# EAGLE design broncho_lung_breakout (EAGLE 9.1.1)
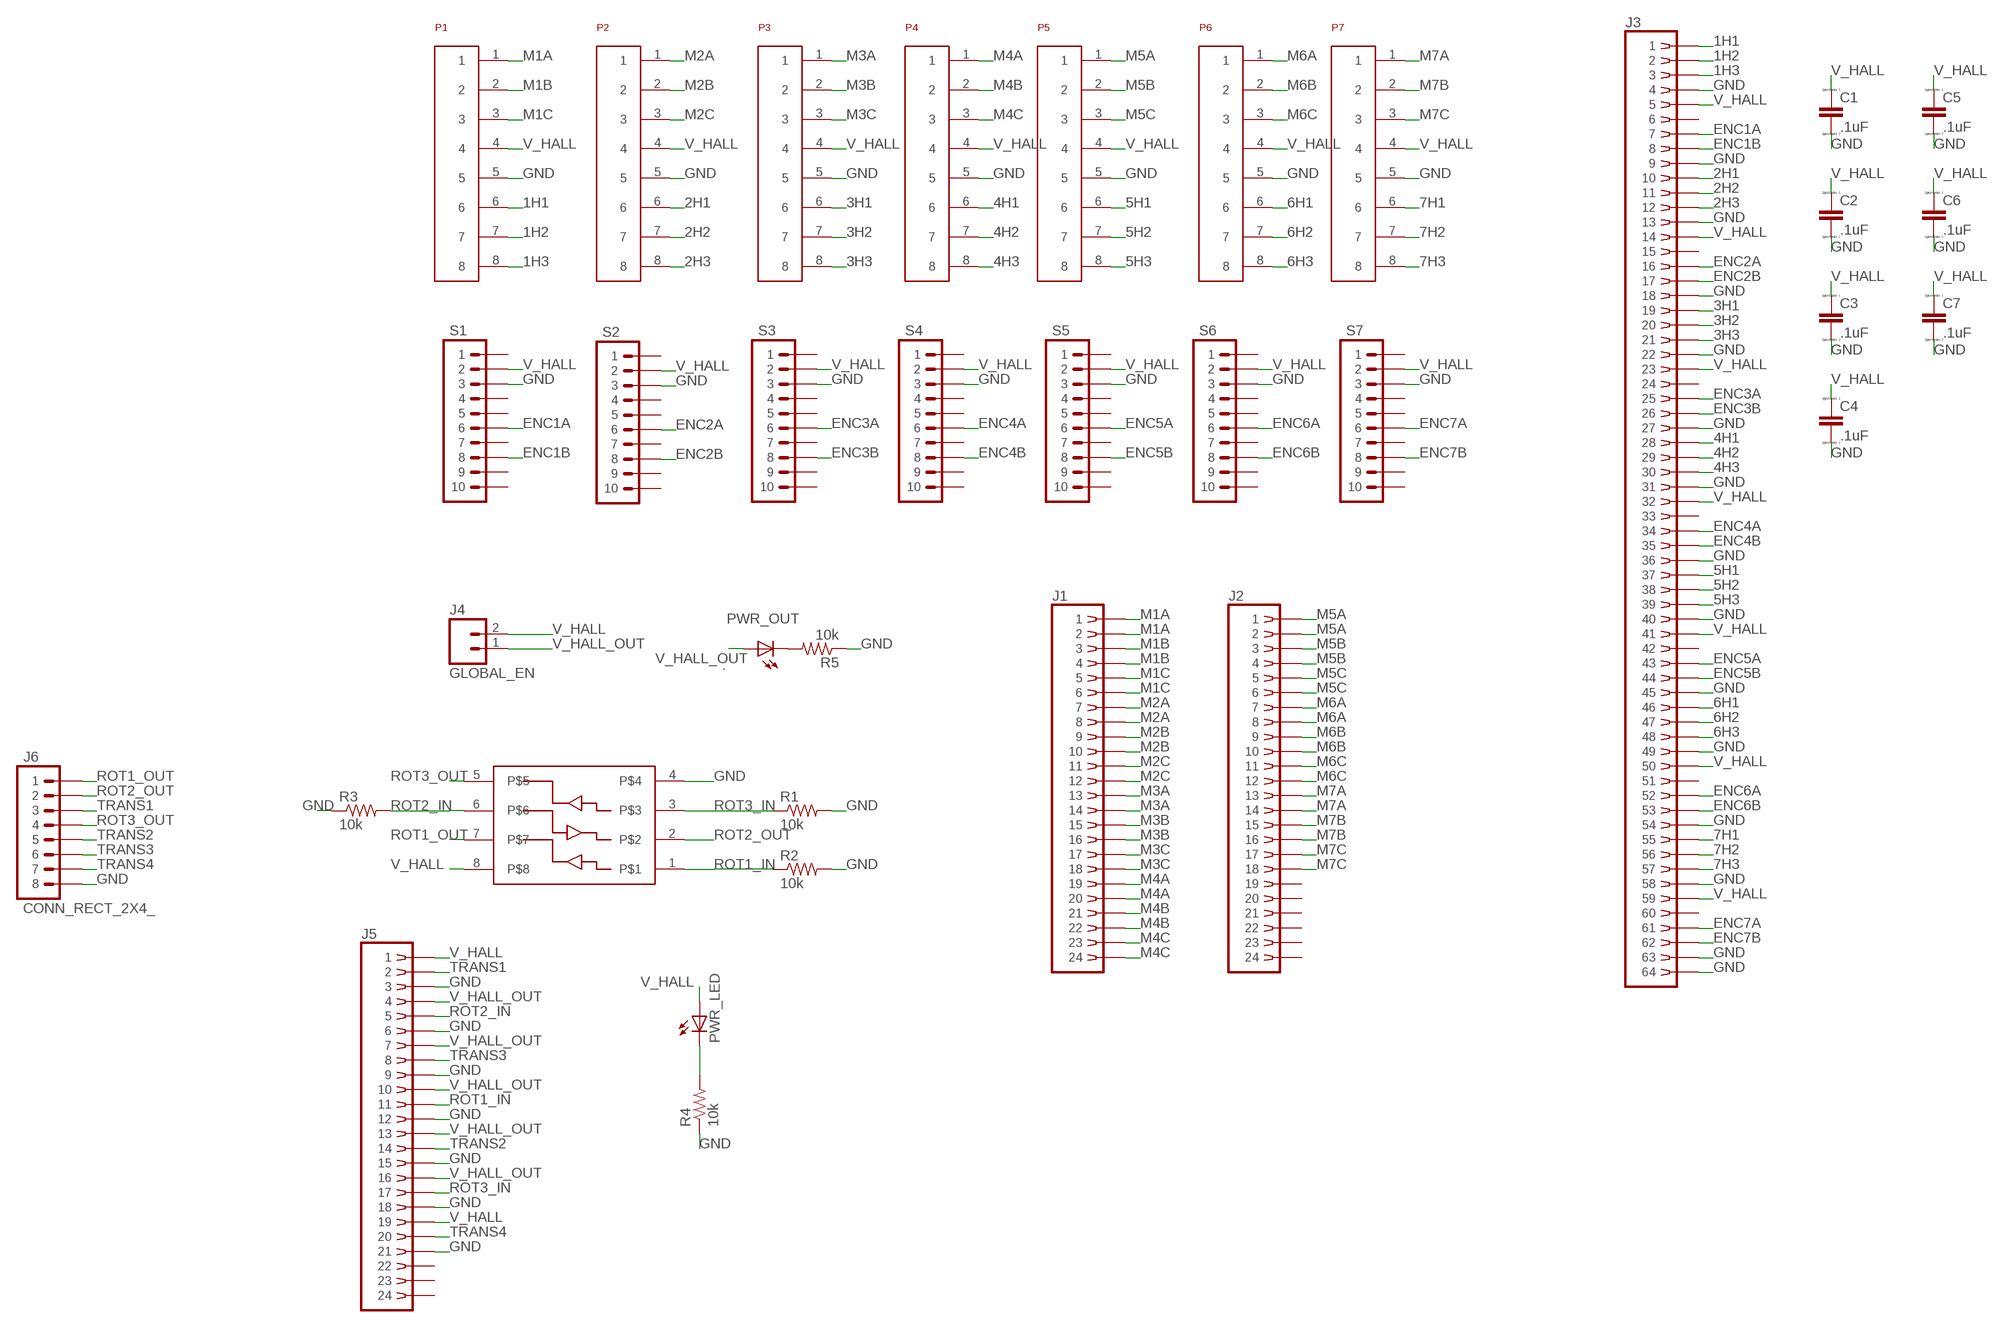
[diagram p0: schematic, sheet 1]

## Parts
C1  .1uF  CC0603  [C0603]
C2  .1uF  CC0603  [C0603]
C3  .1uF  CC0603  [C0603]
C4  .1uF  CC0603  [C0603]
C5  .1uF  CC0603  [C0603]
C6  .1uF  CC0603  [C0603]
C7  .1uF  CC0603  [C0603]
J1  CONN_RECT_2X12TH  [CONN_IDC_24_MALE_TH]
J2  CONN_RECT_2X12TH  [CONN_IDC_24_MALE_TH]
J3  CONN_RECT_2X32NOHOLES  [CONN_IDC_64_MALE_TH_NOHOLES]
J4  GLOBAL_EN  22-27-2021-02  [6410-02]
J5  CONN_RECT_2X12TH  [CONN_IDC_24_MALE_TH]
J6  CONN_RECT_2X4_  [2X4]
P1  MKS-1650  [MKS-1650]
P2  MKS-1650  [MKS-1650]
P3  MKS-1650  [MKS-1650]
P4  MKS-1650  [MKS-1650]
P5  MKS-1650  [MKS-1650]
P6  MKS-1650  [MKS-1650]
P7  MKS-1650  [MKS-1650]
PWR_LED  .  LED-0805  [LED-0805]
PWR_OUT  .  LED-0805  [LED-0805]
R1  10k  RESISTOR-0603  [0603-RES]
R2  10k  RESISTOR-0603  [0603-RES]
R3  10k  RESISTOR-0603  [0603-RES]
R4  10k  RESISTOR-0603  [0603-RES]
R5  10k  RESISTOR-0603  [0603-RES]
S1  CONN_RECT_2X5'_VERT  [2X5]
S2  CONN_RECT_2X5'_VERT  [2X5]
S3  CONN_RECT_2X5'_VERT  [2X5]
S4  CONN_RECT_2X5'_VERT  [2X5]
S5  CONN_RECT_2X5'_VERT  [2X5]
S6  CONN_RECT_2X5'_VERT  [2X5]
S7  CONN_RECT_2X5'_VERT  [2X5]
U1  INVERTER_3INP  [SOP65P405X120-8]

## Nets
1H1: J3.P$1 P1.6
1H2: J3.P$2 P1.7
1H3: J3.P$3 P1.8
2H1: J3.P$10 P2.6
2H2: J3.P$11 P2.7
2H3: J3.P$12 P2.8
3H1: J3.P$19 P3.6
3H2: J3.P$20 P3.7
3H3: J3.P$21 P3.8
4H1: J3.P$28 P4.6
4H2: J3.P$29 P4.7
4H3: J3.P$30 P4.8
5H1: J3.P$37 P5.6
5H2: J3.P$38 P5.7
5H3: J3.P$39 P5.8
6H1: J3.P$46 P6.6
6H2: J3.P$47 P6.7
6H3: J3.P$48 P6.8
7H1: J3.P$55 P7.6
7H2: J3.P$56 P7.7
7H3: J3.P$57 P7.8
ENC1A: J3.P$7 S1.6
ENC1B: J3.P$8 S1.8
ENC2A: J3.P$16 S2.6
ENC2B: J3.P$17 S2.8
ENC3A: J3.P$25 S3.6
ENC3B: J3.P$26 S3.8
ENC4A: J3.P$34 S4.6
ENC4B: J3.P$35 S4.8
ENC5A: J3.P$43 S5.6
ENC5B: J3.P$44 S5.8
ENC6A: J3.P$52 S6.6
ENC6B: J3.P$53 S6.8
ENC7A: J3.P$61 S7.6
ENC7B: J3.P$62 S7.8
GND: C1.2 C2.2 C3.2 C4.2 C5.2 C6.2 C7.2 J3.P$4 J3.P$9 J3.P$13 J3.P$18 J3.P$22 J3.P$27 J3.P$31 J3.P$36 J3.P$40 J3.P$45 J3.P$49 J3.P$54 J3.P$58 J3.P$63 J3.P$64 J5.P$3 J5.P$6 J5.P$9 J5.P$12 J5.P$15 J5.P$18 J5.P$21 J6.8 P1.5 P2.5 P3.5 P4.5 P5.5 P6.5 P7.5 R1.2 R2.2 R3.1 R4.1 R5.1 S1.3 S2.3 S3.3 S4.3 S5.3 S6.3 S7.3 U1.4
M1A: J1.P$1 J1.P$2 P1.1
M1B: J1.P$3 J1.P$4 P1.2
M1C: J1.P$5 J1.P$6 P1.3
M2A: J1.P$7 J1.P$8 P2.1
M2B: J1.P$9 J1.P$10 P2.2
M2C: J1.P$11 J1.P$12 P2.3
M3A: J1.P$13 J1.P$14 P3.1
M3B: J1.P$15 J1.P$16 P3.2
M3C: J1.P$17 J1.P$18 P3.3
M4A: J1.P$19 J1.P$20 P4.1
M4B: J1.P$21 J1.P$22 P4.2
M4C: J1.P$23 J1.P$24 P4.3
M5A: J2.P$1 J2.P$2 P5.1
M5B: J2.P$3 J2.P$4 P5.2
M5C: J2.P$5 J2.P$6 P5.3
M6A: J2.P$7 J2.P$8 P6.1
M6B: J2.P$9 J2.P$10 P6.2
M6C: J2.P$11 J2.P$12 P6.3
M7A: J2.P$13 J2.P$14 P7.1
M7B: J2.P$15 J2.P$16 P7.2
M7C: J2.P$17 J2.P$18 P7.3
N$1: PWR_OUT.C R5.2
N$2: PWR_LED.C R4.2
ROT1_IN: J5.P$11 R2.1 U1.1
ROT1_OUT: J6.1 U1.7
ROT2_IN: J5.P$5 R3.2 U1.6
ROT2_OUT: J6.2 U1.2
ROT3_IN: J5.P$17 R1.1 U1.3
ROT3_OUT: J6.4 U1.5
TRANS1: J5.P$2 J6.3
TRANS2: J5.P$14 J6.5
TRANS3: J5.P$8 J6.6
TRANS4: J5.P$20 J6.7
V_HALL: C1.1 C2.1 C3.1 C4.1 C5.1 C6.1 C7.1 J3.P$5 J3.P$14 J3.P$23 J3.P$32 J3.P$41 J3.P$50 J3.P$59 J4.2 J5.P$1 J5.P$19 P1.4 P2.4 P3.4 P4.4 P5.4 P6.4 P7.4 PWR_LED.A S1.2 S2.2 S3.2 S4.2 S5.2 S6.2 S7.2 U1.8
V_HALL_OUT: J4.1 J5.P$4 J5.P$7 J5.P$10 J5.P$13 J5.P$16 PWR_OUT.A
Unconnected: J2.P$19 J2.P$20 J2.P$21 J2.P$22 J2.P$23 J2.P$24 J3.P$6 J3.P$15 J3.P$24 J3.P$33 J3.P$42 J3.P$51 J3.P$60 J5.P$22 J5.P$23 J5.P$24 S1.1 S1.4 S1.5 S1.7 S1.9 S1.10 S2.1 S2.4 S2.5 S2.7 S2.9 S2.10 S3.1 S3.4 S3.5 S3.7 S3.9 S3.10 S4.1 S4.4 S4.5 S4.7 S4.9 S4.10 S5.1 S5.4 S5.5 S5.7 S5.9 S5.10 S6.1 S6.4 S6.5 S6.7 S6.9 S6.10 S7.1 S7.4 S7.5 S7.7 S7.9 S7.10

## Library data of the parts
C1-C7 = eagle-ltspice:C: CAPACITOR, European symbol; SPICEMODEL: NONE; SPICEPREFIX: C
J1 J2 J5 = Cannula_1_0:CONN_RECT_2X12
J3 = Cannula_1_0:CONN_RECT_2X32
J4 = Cannula_1_0:22-?-02: CONNECTOR wire to board 2.54 mm (.1 inch) pitch header; OC_FARNELL: unknown; OC_NEWARK: unknown
J6 = Cannula_1_0:CONN_RECT_2X4
P1-P7 = stocko_rfk_conn:MKS-1650: MKS 1650 8 Pin Connector Stocko-Contact Designed by Max Emerson Link to datasheet <https://www.stocko-contact.com/info-pdf/rfk_1650.pdf>
PWR_LED PWR_OUT = Cannula_1_0:LED
R1-R5 = Cannula_1_0:RESISTOR
S1-S7 = Cannula_1_0:CONN_RECT_2X5
U1 = SOP65P405X120-8:INVERTER_3INP

## Net classes
1 M1A: width 0.508 mm
2 M1B: width 0.508 mm
3 M1C: width 0.508 mm
4 M2A: width 0.508 mm
5 M2B: width 0.508 mm
6 M2C: width 0.508 mm
7 M3A: width 0.508 mm
8 M3B: width 0.508 mm
9 M3C: width 0.508 mm
10 M4A: width 0.508 mm
11 M4B: width 0.508 mm
12 M4C: width 0.508 mm
13 M5A: width 0.508 mm
14 M5B: width 0.508 mm
15 M5C: width 0.508 mm

## Board
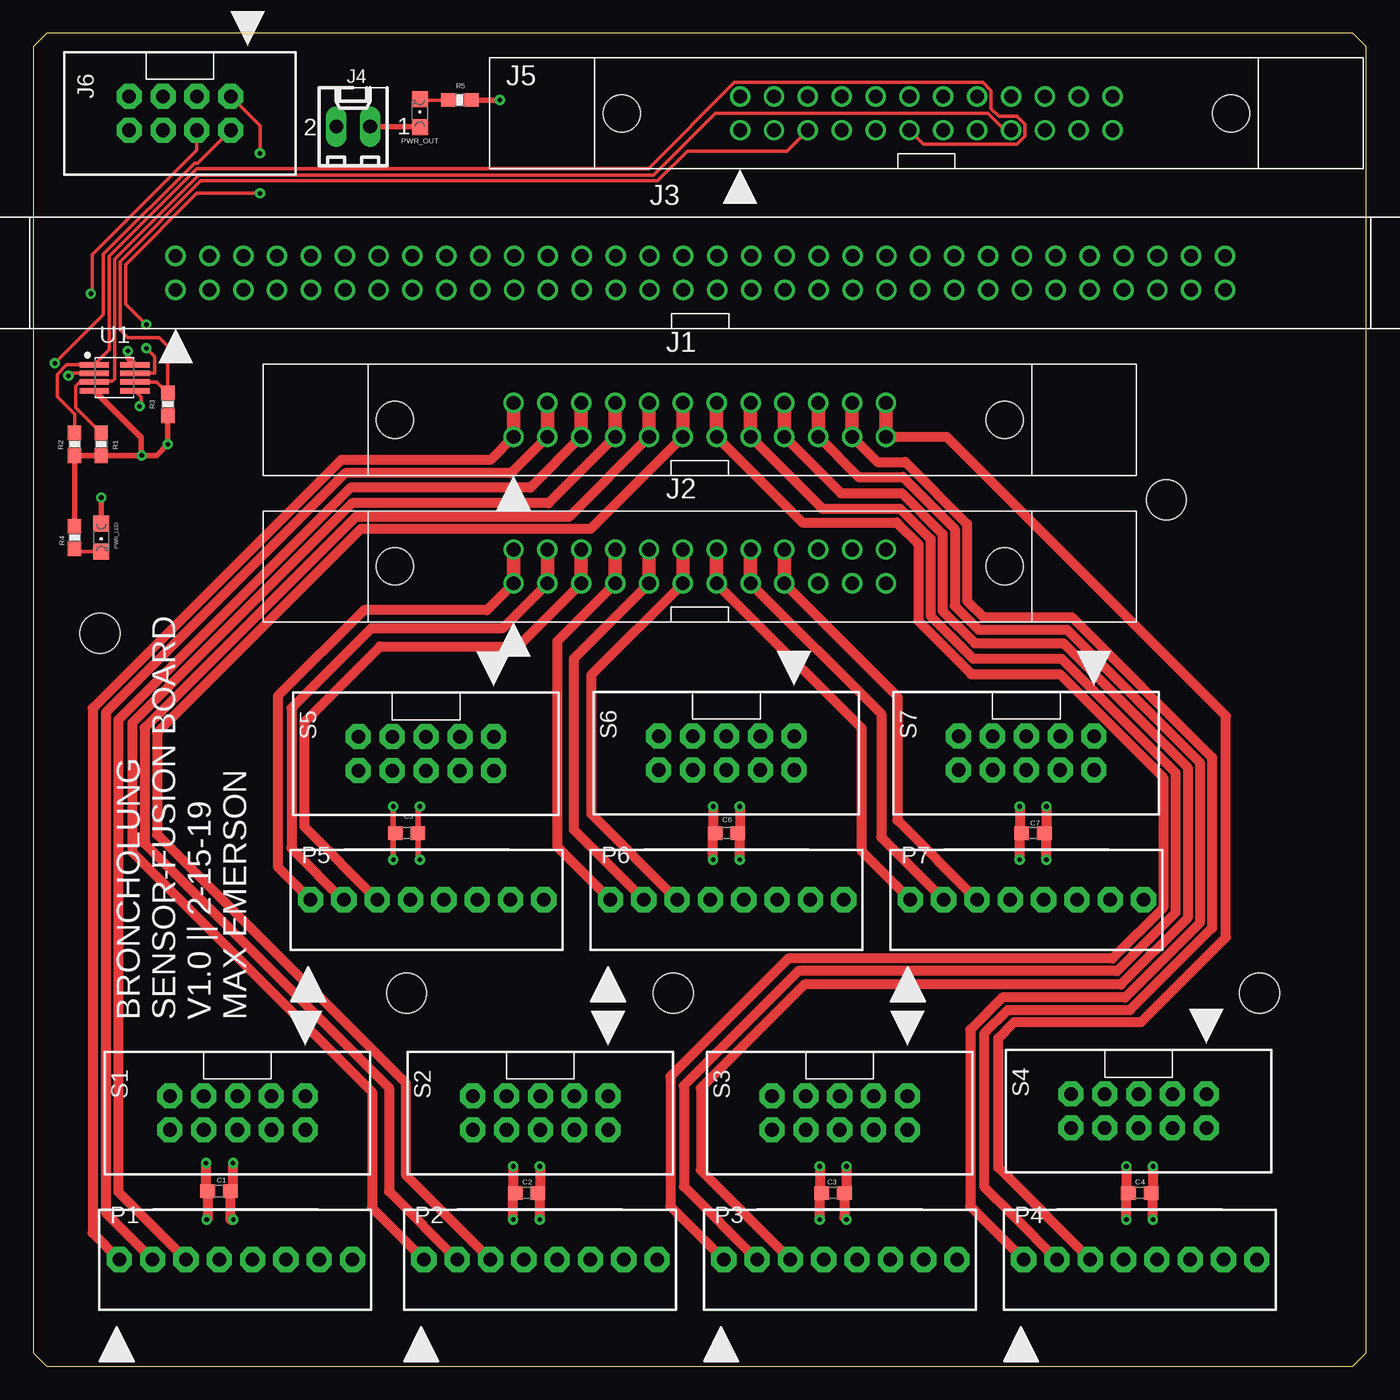
[diagram p1: board, top side]
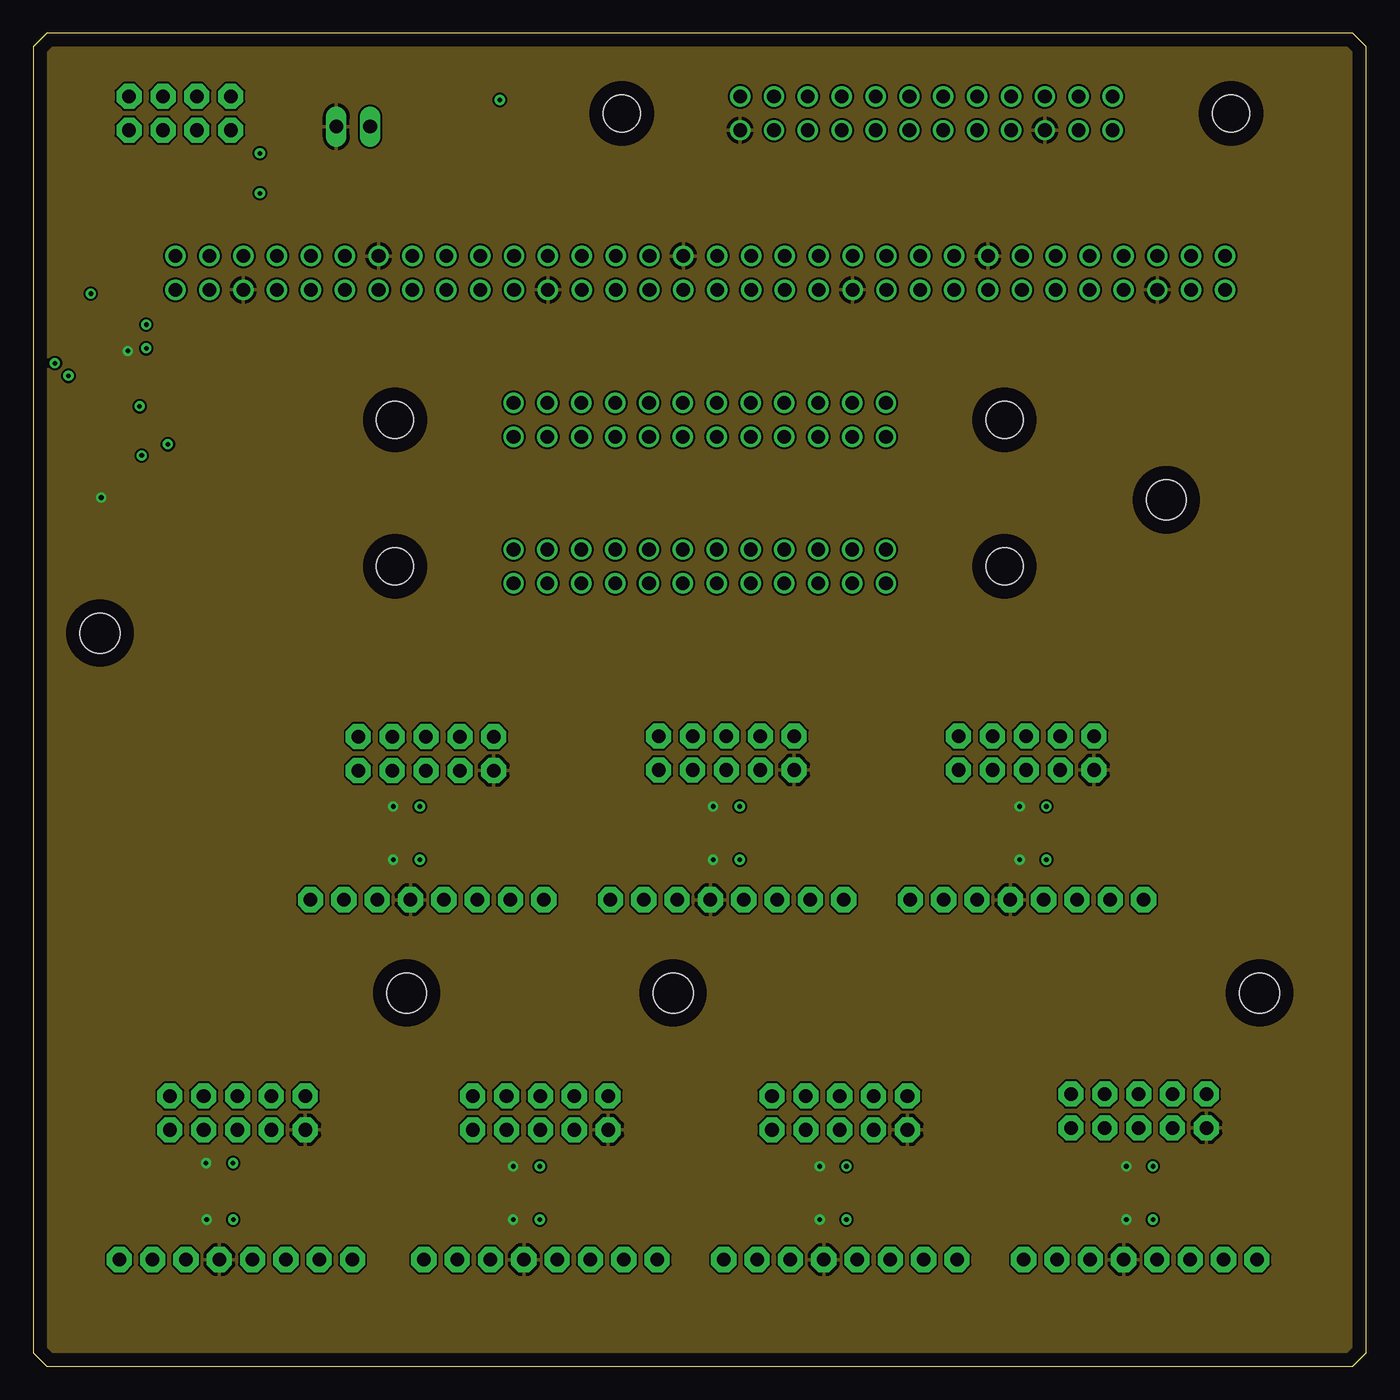
[diagram p2: board, inner layer Route2]
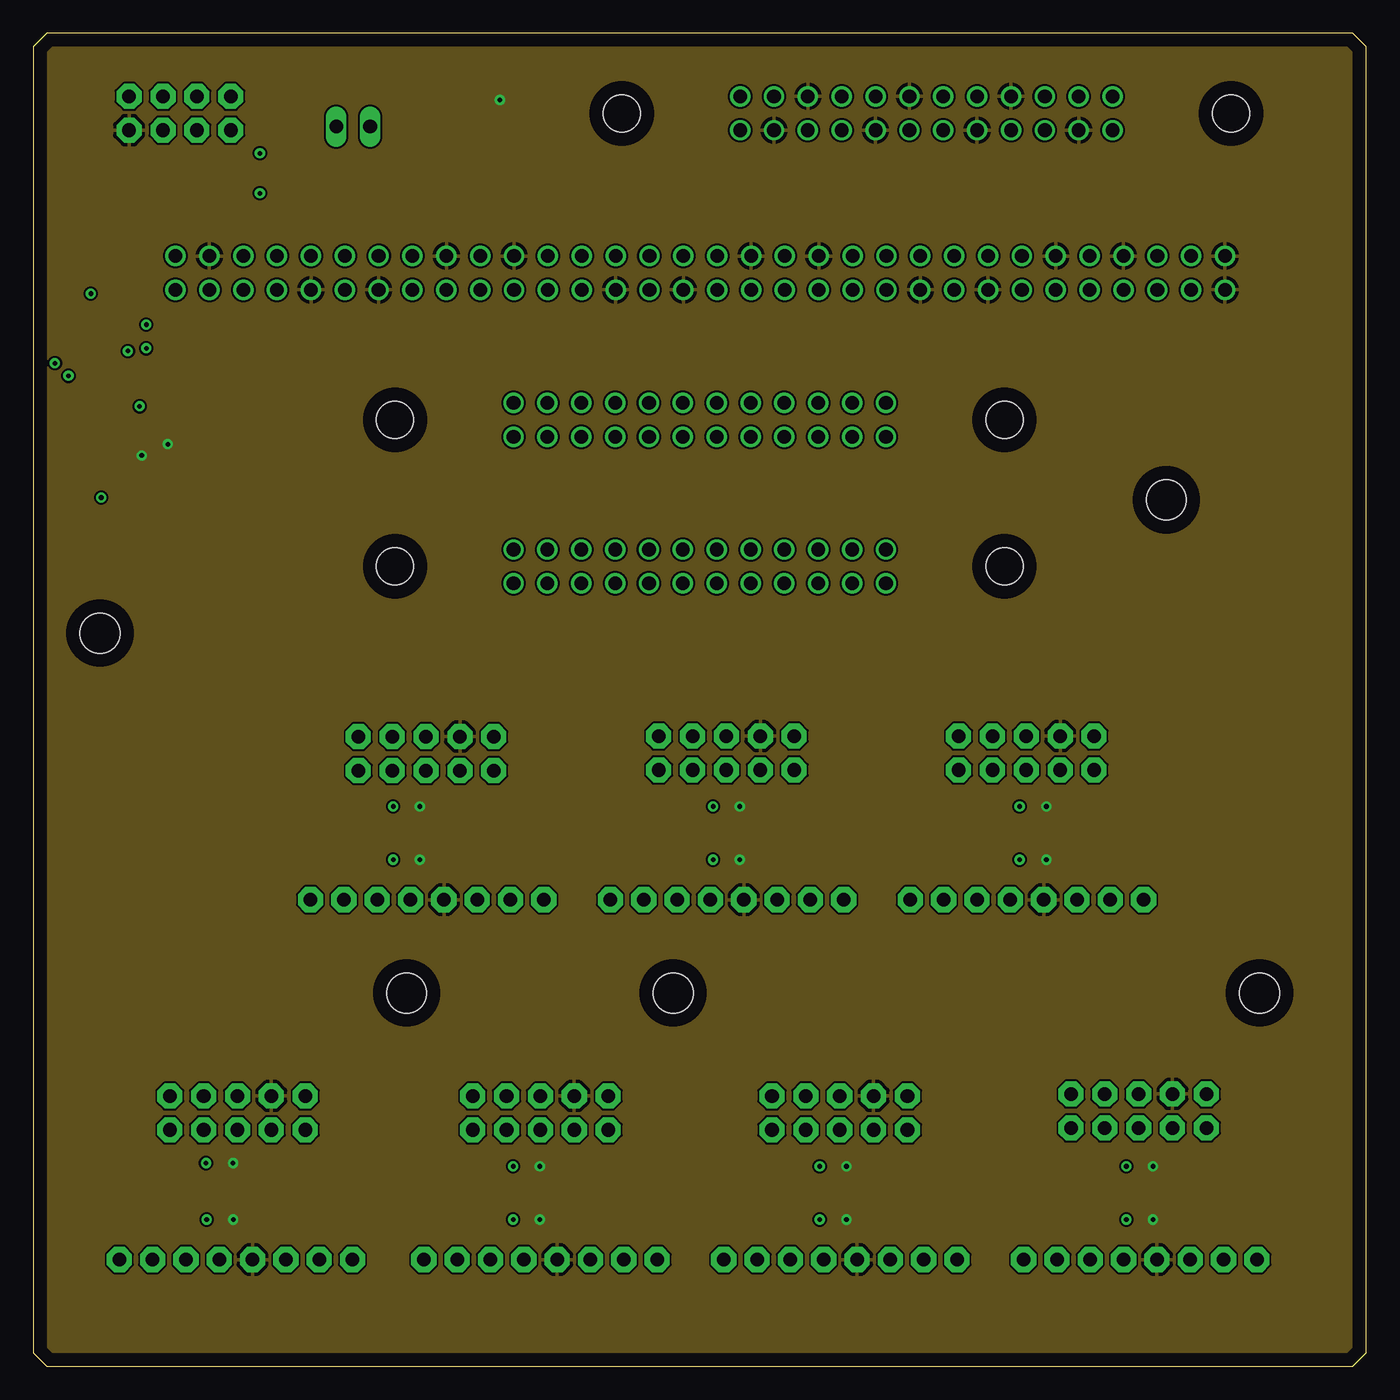
[diagram p3: board, inner layer Route15]
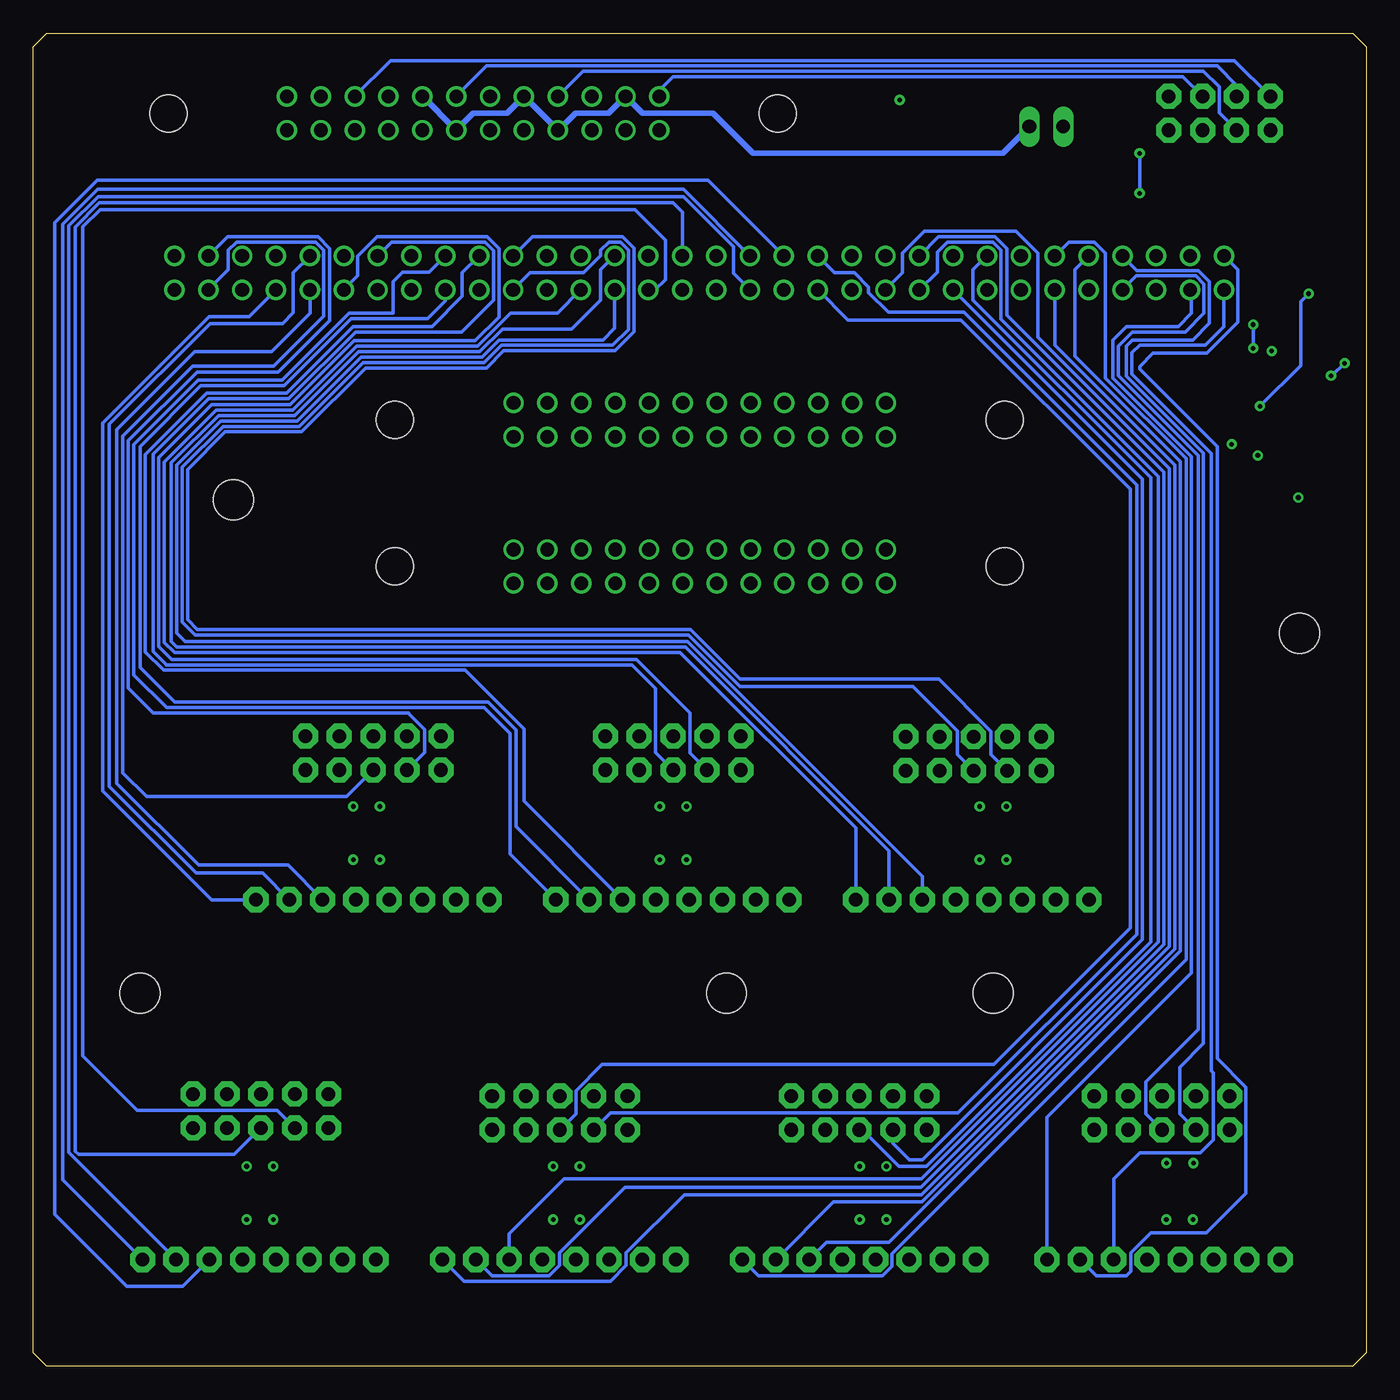
[diagram p4: board, bottom side, seen from below]

Size 100 x 100 mm. Coordinates in mm from the lower left corner, seen from the top.
Outline: 0,99 0,1 1,0 99,0 100,1 100,99 99,100 1,100 0,99
Copper layers (1*2*15*16): Top 0.035mm / dielectric 1.5mm / Route2 0.035mm / dielectric 0.15mm / Route15 0.035mm / dielectric 0.2mm / Bottom 0.035mm
Design rules "default *": minimum track width 10mil, minimum drill 0.35mm, track to track 6mil, track to pad 6mil, pad to pad 6mil, via to via 6mil, smd to smd 6mil, copper to edge 40mil, drill to drill 6mil, minimum pad ring 10mil, minimum via ring 8mil, stop-mask expansion 4mil, vias tented up to drill 0mil, thermal gap 10mil
Holes 3 mm at 28,28 48,28 5,55 92,28 85,65

### Footprints (pad centres in the part's own frame; a part is rotated, then mirrored left to right if it is on the bottom)
C0603 = smd 1.1 x 1: 1 -0.85,0; 2 0.85,0
CONN_IDC_24_MALE_TH = drill 1.02: P$1 -13.97,-1.27; P$2 -13.97,1.27; P$3 -11.43,-1.27; P$4 -11.43,1.27; P$5 -8.89,-1.27; P$6 -8.89,1.27; P$7 -6.35,-1.27; P$8 -6.35,1.27; P$9 -3.81,-1.27; P$10 -3.81,1.27; P$11 -1.27,-1.27; P$12 -1.27,1.27; P$13 1.27,-1.27; P$14 1.27,1.27; P$15 3.81,-1.27; P$16 3.81,1.27; P$17 6.35,-1.27; P$18 6.35,1.27; P$19 8.89,-1.27; P$20 8.89,1.27; P$21 11.43,-1.27; P$22 11.43,1.27; P$23 13.97,-1.27; P$24 13.97,1.27 | hole 2.794: -22.86,0; 22.86,0
CONN_IDC_64_MALE_TH_NOHOLES = drill 1.02: P$1 -39.37,-1.27; P$2 -39.37,1.27; P$3 -36.83,-1.27; P$4 -36.83,1.27; P$5 -34.29,-1.27; P$6 -34.29,1.27; P$7 -31.75,-1.27; P$8 -31.75,1.27; P$9 -29.21,-1.27; P$10 -29.21,1.27; P$11 -26.67,-1.27; P$12 -26.67,1.27; P$13 -24.13,-1.27; P$14 -24.13,1.27; P$15 -21.59,-1.27; P$16 -21.59,1.27; P$17 -19.05,-1.27; P$18 -19.05,1.27; P$19 -16.51,-1.27; P$20 -16.51,1.27; P$21 -13.97,-1.27; P$22 -13.97,1.27; P$23 -11.43,-1.27; P$24 -11.43,1.27; P$25 -8.89,-1.27; P$26 -8.89,1.27; P$27 -6.35,-1.27; P$28 -6.35,1.27; P$29 -3.81,-1.27; P$30 -3.81,1.27; P$31 -1.27,-1.27; P$32 -1.27,1.27; P$33 1.27,-1.27; P$34 1.27,1.27; P$35 3.81,-1.27; P$36 3.81,1.27; P$37 6.35,-1.27; P$38 6.35,1.27; P$39 8.89,-1.27; P$40 8.89,1.27; P$41 11.43,-1.27; P$42 11.43,1.27; P$43 13.97,-1.27; P$44 13.97,1.27; P$45 16.51,-1.27; P$46 16.51,1.27; P$47 19.05,-1.27; P$48 19.05,1.27; P$49 21.59,-1.27; P$50 21.59,1.27; P$51 24.13,-1.27; P$52 24.13,1.27; P$53 26.67,-1.27; P$54 26.67,1.27; P$55 29.21,-1.27; P$56 29.21,1.27; P$57 31.75,-1.27; P$58 31.75,1.27; P$59 34.29,-1.27; P$60 34.29,1.27; P$61 36.83,-1.27; P$62 36.83,1.27; P$63 39.37,-1.27; P$64 39.37,1.27
6410-02 = drill 1.016 long: 1 1.27,0; 2 -1.27,0
2X4 = drill 1.016 pad 1.88 octagon: 1 -1.27,3.81; 2 1.27,3.81; 3 -1.27,1.27; 4 1.27,1.27; 5 -1.27,-1.27; 6 1.27,-1.27; 7 -1.27,-3.81; 8 1.27,-3.81
MKS-1650 = drill 1.016 pad 1.88 octagon: 1 -8.7,0; 2 -6.2,0; 3 -3.7,0; 4 -1.2,0; 5 1.3,0; 6 3.8,0; 7 6.3,0; 8 8.8,0
LED-0805 = smd 1.2 x 1.2: A 0,-1.05; C 0,1.05
0603-RES = smd 1.1 x 1: 1 -0.85,0; 2 0.85,0
2X5 = drill 1.016 pad 1.88 octagon: 1 -1.27,5.08; 2 1.27,5.08; 3 -1.27,2.54; 4 1.27,2.54; 5 -1.27,0; 6 1.27,0; 7 -1.27,-2.54; 8 1.27,-2.54; 9 -1.27,-5.08; 10 1.27,-5.08
SOP65P405X120-8 = smd 2.196 x 0.412: 1 -1.527,0.975; 2 -1.527,0.325; 3 -1.527,-0.325; 4 -1.527,-0.975; 5 1.527,-0.975; 6 1.527,-0.325; 7 1.527,0.325; 8 1.527,0.975

### Placement (x,y rotation side)
C1  13.93,13.13 0 top
C2  37,13 0 top
C3  60,13 0 top
C4  83,13 0 top
C5  28,40 0 top
C6  52,40 0 top
C7  75,40 0 top
J1  50,71 0 top
J2  50,60 0 top
J3  50.04,82.03 0 top
J4  24,93 0 top
J5  67,94 0 top
J6  11,94 270 top
P1  15.15,8 0 top
P2  38,8 0 top
P3  60.5,8 0 top
P4  83,8 0 top
P5  29.5,35 0 top
P6  52,35 0 top
P7  74.5,35 0 top
PWR_LED  5.1,62.17 180 top
PWR_OUT  29,94 0 top
R1  5.1,69.17 270 top
R2  3.1,69.17 270 top
R3  10.1,72.17 90 top
R4  3.1,62.17 270 top
R5  32,95 180 top
S1  15.32,19 270 top
S2  38.05,19 270 top
S3  60.5,19 270 top
S4  82.93,19.15 270 top
S5  29.46,45.96 270 top
S6  52,46 270 top
S7  74.5,46 270 top
U1  6.1,74.17 0 top

### Tracks (layer width: path | path; a pad name or v marks a point on that pad's centre or on a via)
1H1
  Bottom 0.254: J3.P$1 10.67,79 10.67,78 | 10.67,78 | 10.67,78 12.07,76.59 17,76.59 17.57,76.03 17.57,74.43 11.61,68.47 11.61,22.15 11.46,22 11.46,17 12.46,16 17,16 18.95,14.05 P1.6
1H2
  Bottom 0.254: P1.7 20.23,6.78 18,6.78 17.67,7.11 17.67,8.51 16.17,10 12,10 9.02,12.98 9.02,20.92 11.18,23.08 11.18,69 | J3.P$2 9.62,82.25 9.62,78.32 11.95,76 16,76 17,75 17,74.82 11.18,69 | 11.18,69
1H3
  Bottom 0.254: J3.P$3 13.1,80.65 13.1,79 14.1,78 18,78 19,77 19,74.14 13.1,68.25 13.1,29.52 23.95,18.67 P1.8
2H1
  Bottom 0.254: J3.P$10 21.87,82.25 21.87,75.78 13.96,67.86 13.96,31.14 35.8,9.3 40.5,9.3 P2.6
2H2
  Bottom 0.254: J3.P$11 23.37,76.61 14.36,67.6 14.36,31.31 33.34,12.33 39.97,12.33 P2.7
2H3
  Bottom 0.254: J3.P$12 22.32,84.34 20.39,84.34 19.56,83.5 19.56,74.13 13.51,68.08 13.51,30.51 35.58,8.44 35.58,7.5 36.3,6.78 45.58,6.78 P2.8
3H1
  Bottom 0.254: J3.P$19 32.19,82.1 32.19,83.58 31.42,84.34 28.02,84.34 27.4,83.73 27.4,78.57 15.58,66.74 15.58,31.83 33.37,14.04 60.18,14.04 64.3,9.91 P3.6
3H2
  Bottom 0.254: J3.P$20 32.08,84.75 27.85,84.75 26.95,83.85 26.95,78.87 15.17,67.09 15.17,31.65 33.4,13.43 55.6,13.43 60.52,8.51 60.52,7.56 61.3,6.78 65.58,6.78 P3.7
3H3
  Bottom 0.254: J3.P$21 34.8,82.03 34.8,83.5 33.15,85.15 26.29,85.15 24.64,83.5 24.64,77.21 14.77,67.34 14.77,31.48 33.38,12.87 51.16,12.87 55.52,8.51 55.52,7.56 56.7,6.37 67.67,6.37 P3.8
4H1
  Bottom 0.254: P4.6 88.8,6 93,6 98.41,11.41 98.41,85.8 95.21,89 49.39,89 J3.P$28
4H2
  Bottom 0.254: P4.7 97.35,16.05 97.35,85.55 95.15,87.76 51.23,87.76 47.48,84.01 47.48,82.01 J3.P$29
4H3
  Bottom 0.254: P4.8 97.8,14 97.8,85.68 95.18,88.3 51.23,88.3 J3.P$30
5H1
  Bottom 0.254: J3.P$37 56.39,77.87 57.26,77 65.04,77 66.33,75.71 75.42,75.71 80.21,70.92 85.93,70.92 89.24,67.61 89.24,55 88.6,54.36 50.91,54.36 50.78,54.22 | 50.78,54.22 33.3,36.74 P5.6 | 50.78,54.22
5H2
  Bottom 0.254: J3.P$38 57.43,82.25 57.43,80 59.62,77.81 64.81,77.81 66.5,76.11 75.59,76.11 80.38,71.32 86.1,71.32 89.65,67.78 89.65,54.35 89.24,53.95 51.08,53.95 35.8,38.67 P5.7
5H3
  Bottom 0.254: P5.8 38.3,40.37 51.47,53.55 89.41,53.55 90.17,54.3 90.17,67.83 86.27,71.73 80.55,71.73 75.76,76.52 66.67,76.52 64.19,79 60.68,79 J3.P$39
6H1
  Bottom 0.254: P6.6 63.19,42.39 63.19,47.81 67.59,52.22 90.22,52.22 91.59,53.59 91.59,68.41 87,73 81,73 76,78 70.08,78 67.82,80.26 67.82,82.03 J3.P$46
6H2
  Bottom 0.254: P6.7 63.79,40.49 63.79,47.72 65.88,49.81 89.41,49.81 92,52.41 92,69 87.43,73.57 81.18,73.57 76.16,78.59 70.41,78.59 69.09,79.91 J3.P$47
6H3
  Bottom 0.254: P6.8 64.24,38.44 64.24,47.48 66.17,49.41 90,49.41 92.47,51.87 92.47,69.15 87.64,73.98 81.35,73.98 76.32,79 73,79 73,81.38 72.3,82.08 70.3,82.08 J3.P$48
7H1
  Bottom 0.254: J3.P$55 79.25,79 82.12,76.12 87.88,76.12 93.73,70.27 93.73,43.73 87.59,37.59 80.89,37.59 P7.6
7H2
  Bottom 0.254: P7.7 82.8,37 87.8,37 94.29,43.49 94.29,70.68 86.74,78.23 81.31,78.23 80.51,79.03 80.51,82.03 J3.P$56
7H3
  Bottom 0.254: P7.8 86.62,35 94.79,43.16 94.79,70.76 86.79,78.76 83.79,78.76 J3.P$57
ENC1A
  Bottom 0.254: J3.P$7 17.24,81.8 12.78,81.8 12.16,81.19 12.16,79 13.57,77.59 17.53,77.59 18.59,76.53 18.59,74.31 12.61,68.33 12.61,25.25 16.54,21.32 16.54,18.95 S1.6
ENC1B
  Bottom 0.254: J3.P$8 17.2,82.21 12.61,82.21 11.76,81.36 11.76,78.24 13,77 17.55,77 18,76.55 18,74.29 12.2,68.5 12.2,24.21 14,22.42 14,18.95 S1.8
ENC2A
  Bottom 0.254: J3.P$16 29.49,82.25 29.49,79.99 16.16,66.66 16.16,31.83 33,14.99 35.05,14.99 37.79,17.73 S2.6
ENC2B
  Bottom 0.254: J3.P$17 16.78,66.55 16.78,32.01 33.31,15.48 34.26,15.48 35.51,16.73 S2.8
ENC3A
  Bottom 0.254: S3.6 59.28,18.95 59.28,20.67 57.32,22.64 27.94,22.64 17.7,32.87 17.7,65.81 30.39,78.5 38.89,78.5 J3.P$25
ENC3B
  Bottom 0.254: J3.P$26 39.88,82.03 38.4,82.03 37.34,80.96 37.34,80.55 35.86,79.07 30.18,79.07 17.22,66.11 17.22,32.4 30.61,19 56.69,19 S3.8
ENC4A
  Bottom 0.254: S4.6 84.93,15.88 96.6,15.88 96.86,16.14 96.86,85.47 95.05,87.28 52,87.28 51.31,86.59 J3.P$34
ENC4B
  Bottom 0.254: S4.8 81.71,19.2 92.2,19.2 96.28,23.28 96.28,85.48 95,86.76 54.85,86.76 54.05,85.95 53.85,85.76 52.58,84.49 52.58,81.53 53.36,80.76 J3.P$35
ENC5A
  Bottom 0.254: J3.P$43 62.74,82.03 58.72,82.03 57.43,83.31 57.43,83.73 56.82,84.34 55.95,84.34 55.34,83.73 55.34,77.78 56.53,76.59 64.87,76.59 66.17,75.3 75.25,75.3 80.04,70.51 85.77,70.51 88.83,67.44 88.83,55.83 87.86,54.86 50.85,54.86 46.96,50.98 34.02,50.98 30.68,47.64 30.68,45.91 S5.6
ENC5B
  Bottom 0.254: J3.P$44 62.56,84.75 55.79,84.75 54.94,83.9 54.94,80.06 | S5.8 28.14,45.91 28.14,47.63 32.07,51.56 46.97,51.56 50.68,55.27 87.7,55.27 88.43,56 88.43,67.28 85.6,70.1 79.87,70.1 75.08,74.89 66,74.89 64.7,76.19 56.37,76.19 54.94,77.61 54.94,80.06 | 54.94,80.06
ENC6A
  Bottom 0.254: J3.P$52 73.12,84.34 66.11,84.34 65.46,83.68 65.46,80 67.86,77.59 75.83,77.59 80.83,72.59 86.83,72.59 91,68.42 91,53.62 90,52.62 | S6.6 53.32,46.05 53.32,50.86 55.09,52.62 90,52.62 | 90,52.62 90.05,52.62
ENC6B
  Bottom 0.254: J3.P$53 75.66,81.8 75.66,83.28 74.19,84.75 65.95,84.75 65.05,83.85 65.05,78.71 66.84,76.92 75.92,76.92 80.72,72.14 86.61,72.14 90.59,68.16 90.59,54 89.62,53.03 54.76,53.03 50.73,49 50.73,46 S6.8
ENC7A
  Bottom 0.254: J3.P$61 85.37,82.25 85.37,83.73 84.76,84.34 78.81,84.34 | S7.6 76.5,42.73 91.5,42.73 93.28,44.51 93.28,69.78 88.03,75.03 81.97,75.03 78.2,78.8 78.2,83.73 78.81,84.34 | 78.81,84.34
ENC7B
  Bottom 0.254: J3.P$62 85.42,84.75 78.65,84.75 77.75,83.85 77.75,83 | 77.75,83 77.75,82.86 | S7.8 70.64,46.05 70.64,47.77 71.83,48.96 71.83,49 91,49 92.87,50.87 92.87,69.43 87.72,74.59 81.62,74.59 77.75,78.46 77.75,83
GND  (via drill 0.35)
  Top 0.254: R4.1 2.95,63.17
  Top 0.406: R4.1 R2.2 R1.2 8.1,68.32 | 8.1,68.32 9.25,68.32 v10.1,69.17 R3.1 | U1.4 8.1,69.67 8.1,68.32 | v29,38 28.85,38.15 C5.2 28.85,41.85 v29,42 | R5.1 v35,95
  Top 0.762: v15,11 14.78,11 C1.2 14.99,13.13 v14.99,15.24 | v38,11 38,12.85 | 38,12.85 C2.2 | v38,15 38,12.85 | v61,11 60.85,11.15 C3.2 61,13.15 v61,15 | v84,15 84,13.15 C4.2 84,12.85 v84,11 | v53,42 53,40.15 C6.2 53,39.85 v53,38 | v76,38 76,39.85 C7.2 76,40.15 v76,42
  other vias: 8.13,68.33
  pour Route15: 0,-1 101,-1 102,0 102,102 -1,102 -1,0
M1A
  Top 0.762: P1.1 4.45,10 4.45,49.35 23.1,68 34.3,68 J1.P$1
  Top 1.016: J1.P$2 J1.P$1
M1B
  Top 0.762: P1.2 5.44,11.51 5.44,49.04 23.4,67 35.84,67 J1.P$3
  Top 1.016: J1.P$4 J1.P$3
M1C
  Top 0.762: J1.P$5 37.3,65.92 23.79,65.92 6.37,48.5 6.37,13.08 P1.3
  Top 1.016: J1.P$6 J1.P$5
M2A
  Top 0.762: J1.P$7 38.66,64.74 23.91,64.74 7.42,48.26 7.42,38.57 25.41,20.58 25.41,11.89 P2.1
  Top 1.016: J1.P$8 J1.P$7
M2B
  Top 0.762: J1.P$9 40.18,63.72 24.18,63.72 8.35,47.9 8.35,39.22 26.68,20.89 26.68,13.12 P2.2
  Top 1.016: J1.P$10 J1.P$9
M2C
  Top 0.762: J1.P$11 41.81,62.81 24.56,62.81 9.28,47.53 9.28,39.89 27.93,21.24 27.93,14.37 P2.3
  Top 1.016: J1.P$12 J1.P$11
M3A
  Top 0.762: J1.P$13 57.69,63.31 64.77,63.31 66.39,61.68 66.39,55.91 70.38,51.92 77.01,51.92 84.77,44.16 84.77,34.39 80.97,30.59 56.65,30.59 47.8,21.73 47.8,12 P3.1
  Top 1.016: J1.P$14 J1.P$13
M3B
  Top 0.762: J1.P$15 59.21,64.33 65.03,64.33 67.31,62.06 67.31,56.29 70.5,53.09 77.14,53.09 85.69,44.54 85.69,34.01 81.32,29.64 57.39,29.64 48.81,21.07 48.81,13.49 P3.2
  Top 1.016: J1.P$16 J1.P$15
M3C
  Top 0.762: J1.P$17 60.58,65.5 65.16,65.5 68.22,62.44 68.22,56.66 70.63,54.25 77.27,54.25 86.6,44.92 86.6,33.63 81.6,28.63 57.85,28.63 50.09,20.86 50.09,14.71 P3.3
  Top 1.016: J1.P$18 J1.P$17
M4A
  Top 0.762: J1.P$19 61.9,66.72 65.23,66.72 69.14,62.82 69.14,57.04 70.91,55.27 77.55,55.27 87.52,45.3 87.52,33.25 81.92,27.66 72.71,27.66 70.3,25.24 70.3,12 P4.1
  Top 1.016: J1.P$20 J1.P$19
M4B
  Top 0.762: J1.P$21 63.33,67.83 65.42,67.83 70.05,63.2 70.05,57.42 71.28,56.19 77.92,56.19 88.43,45.67 88.43,32.88 82.28,26.73 73.11,26.73 71.37,24.99 71.37,13.43 73.4,11.4 | 73.38,11.42 73.4,11.4 | 73.4,11.4 P4.2
  Top 1.016: J1.P$22 J1.P$21
M4C
  Top 0.762: J1.P$23 68.52,69.73 89.48,48.77 89.48,32.18 83.11,25.81 73.6,25.81 72.39,24.6 72.39,14.91 P4.3
  Top 1.016: J1.P$24 J1.P$23
M5A
  Top 0.762: P5.1 18.34,37.46 18.34,50.27 24.8,56.73 34.03,56.73 J2.P$1
  Top 1.016: J2.P$2 J2.P$1
M5B
  Top 0.762: J2.P$3 35.2,55.36 25.34,55.36 19.37,49.38 19.37,38.84 23.21,35 P5.2
  Top 1.016: J2.P$4 J2.P$3
M5C
  Top 0.762: P5.3 20.34,40.46 20.34,48.34 26,54 36.38,54 J2.P$5
  Top 1.016: J2.P$6 J2.P$5
M6A
  Top 0.762: J2.P$7 39.3,54.38 39.3,39 P6.1
  Top 1.016: J2.P$8 J2.P$7
M6B
  Top 0.762: J2.P$9 40.53,53.07 40.53,40.27 P6.2
  Top 1.016: J2.P$10 J2.P$9
M6C
  Top 0.762: J2.P$11 41.85,51.85 41.85,41.45 P6.3
  Top 1.016: J2.P$12 J2.P$11
M7A
  Top 0.762: J2.P$13 62.13,47.87 62.13,38.66 P7.1
  Top 1.016: J2.P$14 J2.P$13
M7B
  Top 0.762: J2.P$15 63.62,48.92 63.62,39.68 P7.2
  Top 1.016: J2.P$16 J2.P$15
M7C
  Top 0.762: J2.P$17 64.82,50.26 64.82,40.98 P7.3
  Top 1.016: J2.P$18 J2.P$17
N$1
  Top 0.254: R5.2 29.05,95 PWR_OUT.C
N$2
  Top 0.254: R4.2 3.3,61.12 PWR_LED.C
ROT1_IN
  Top 0.254: R2.1 3.1,71.44 1.78,72.75 1.78,74.41 2.51,75.13 4.56,75.13 U1.1 5.69,76.26 5.69,83.29 12.26,89.86 46.14,89.86 52.6,96.31 71.24,96.31 71.85,95.7 71.85,94.34 72.42,93.77 73.78,93.77 74.39,93.16 74.39,92.3 73.78,91.69 66.77,91.69 J5.P$11
ROT1_OUT  (via drill 0.35)
  Top 0.254: U1.7 9.1,74.49 9.1,75.75 v8.48,76.37 | v8.48,78.15 6.92,79.7 6.92,82.66 12.26,88 v17,88 | v17,91 17,93.08 J6.1
  Bottom 0.254: v17,88 v17,91 | v8.48,76.37 v8.48,78.15
ROT2_IN
  Top 0.254: U1.6 9.27,73.84 R3.2 10.1,76.53 9.46,77.17 7.1,77.17 6.5,77.76 6.5,82.88 12.56,88.94 46.84,88.94 49.06,91.17 56.55,91.17 J5.P$5
ROT2_OUT  (via drill 0.35)
  Top 0.254: U1.2 2.83,74.49 v2.64,74.3 | v1.62,75.25 5.26,78.89 5.26,83.43 12.09,90.27 12.35,90.27 J6.2
  Bottom 0.254: v2.64,74.3 2.57,74.3 v1.62,75.25
ROT3_IN
  Top 0.254: R1.1 3.19,71.92 3.19,73.52 3.49,73.81 4.54,73.81 U1.3 4.62,73.89 5.92,73.89 6.1,74.07 6.1,83.05 12.4,89.35 46.52,89.35 51.17,94.01 71.62,94.01 72.89,92.73 J5.P$17
ROT3_OUT  (via drill 0.35)
  Top 0.254: U1.5 8.1,72.72 8.1,72.14 v7.97,72.02 | J6.4 12.27,91.23 4.41,83.38 4.41,80.57 v4.32,80.47
  Bottom 0.254: v7.97,72.02 4.92,75.07 4.92,79.13 4.92,79.87 v4.32,80.47
TRANS1
  Bottom 0.254: J5.P$2 53.03,95.71 52,96.74 13.74,96.74 J6.3
TRANS2
  Bottom 0.254: J5.P$14 65.98,97.56 11.16,97.56 9.73,96.12 J6.5
TRANS3
  Bottom 0.254: J5.P$8 58.77,97.15 12.21,97.15 11.04,95.98 11.04,94.04 J6.6
TRANS4
  Bottom 0.254: J5.P$20 73.2,97.96 9.88,97.96 J6.7
V_HALL  (via drill 0.35)
  Top 0.406: PWR_LED.A v5.1,65.17 | U1.8 7.1,75.67 v7.1,76.17 | v27,42 27,40.15 C5.1 27,39.85 v27,38
  Top 0.762: v13,11 13.08,11 C1.1 12.95,13.13 v12.95,15.24 | v36,11 36,12.85 C2.1 36,13.15 v36,15 | v59,11 59,12.85 C3.1 59,13.15 v59,15 | v82,11 82,12.85 C4.1 82,13.15 v82,15 | v51,38 51,39.85 | 51,39.85 C6.1 | v51,42 51,39.85 | v74,38 74,39.85 C7.1 74,40.15 v74,42
  pour Route2: -1,101 99,101 102,98 102,0 100,-2 -1,-2
V_HALL_OUT
  Top 0.406: J4.1 28.95,93 PWR_OUT.A
  Bottom 0.254: 60.59,92.73 J5.P$7
  Bottom 0.406: 60.59,92.73 59.31,94.01 56.83,94.01 J5.P$4 54.3,94 49,94 46,91 43,91 27.27,91 J4.1 | J5.P$16 J5.P$13 67,94 64.46,94 J5.P$10 J5.P$7

### Text on the board
tPlace: BRONCHOLUNG / SENSOR-FUSION BOARD / V1.0 || 2-15-19 / MAX EMERSON